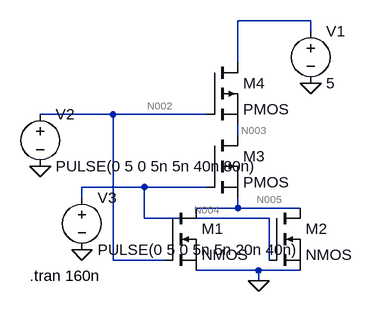
[diagram p0: schematic Exp_4_NOR.asc]
Exp_4_NOR.asc, the LTspice schematic file:
Version 4
SHEET 1 880 680
WIRE 320 -96 208 -96
WIRE 320 -80 320 -96
WIRE 208 -32 208 -96
WIRE 16 48 -96 48
WIRE 160 48 16 48
WIRE 208 80 208 64
WIRE 64 160 -32 160
WIRE 160 160 64 160
WIRE -32 176 -32 160
WIRE 208 192 208 176
WIRE 208 192 144 192
WIRE 304 192 208 192
WIRE 64 208 64 160
WIRE 256 208 64 208
WIRE 16 272 16 48
WIRE 96 272 16 272
WIRE 256 272 256 208
WIRE 240 288 144 288
WIRE 304 288 240 288
WIRE 240 304 240 288
FLAG 320 0 0
FLAG -96 128 0
FLAG -32 256 0
FLAG 240 304 0
SYMBOL nmos 96 192 R0
SYMATTR InstName M1
SYMBOL nmos 256 192 R0
SYMATTR InstName M2
SYMBOL pmos 160 80 R0
SYMATTR InstName M3
SYMBOL pmos 160 -32 R0
SYMATTR InstName M4
SYMBOL voltage 320 -96 R0
WINDOW 123 0 0 Left 0
WINDOW 39 0 0 Left 0
SYMATTR InstName V1
SYMATTR Value 5
SYMBOL voltage -96 32 R0
WINDOW 123 0 0 Left 0
WINDOW 39 0 0 Left 0
SYMATTR InstName V2
SYMATTR Value PULSE(0 5 0 5n 5n 40n 80n)
SYMBOL voltage -32 160 R0
WINDOW 123 0 0 Left 0
WINDOW 39 0 0 Left 0
SYMATTR InstName V3
SYMATTR Value PULSE(0 5 0 5n 5n 20n 40n)
TEXT -112 296 Left 2 !.tran 160n

The netlist it stands for:
* Exp_4_NOR.asc
M1 N005 N002 0 0 NMOS
M2 N005 N004 0 0 NMOS
M3 N003 N004 N005 N005 PMOS
M4 N001 N002 N003 N003 PMOS
V1 N001 0 5
V2 N002 0 PULSE(0 5 0 5n 5n 40n 80n)
V3 N004 0 PULSE(0 5 0 5n 5n 20n 40n)
.model NMOS NMOS
.model PMOS PMOS
.lib standard.mos
.tran 160n
.backanno
.end

* Results of the author's LTspice run, read from the files saved beside the schematic
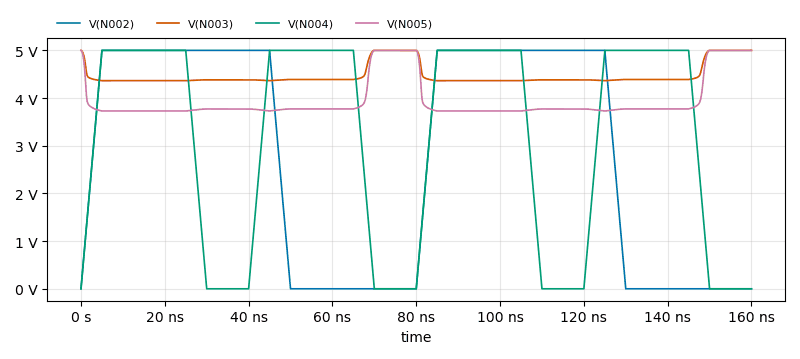
[diagram p1: Transient Analysis of Exp_4_NOR.asc, plotted from the saved traces]
* Transient Analysis, 1 run:
*   V(N002): min 0 V, max 5 V, average 2.812 V, rms 3.68 V, last 0 V
*   V(N003): min 4.365 V, max 5 V, average 4.477 V, rms 4.483 V, last 5 V
*   V(N004): min 0 V, max 5 V, average 3.125 V, rms 3.819 V, last 0 V
*   V(N005): min 3.729 V, max 5 V, average 3.952 V, rms 3.976 V, last 5 V